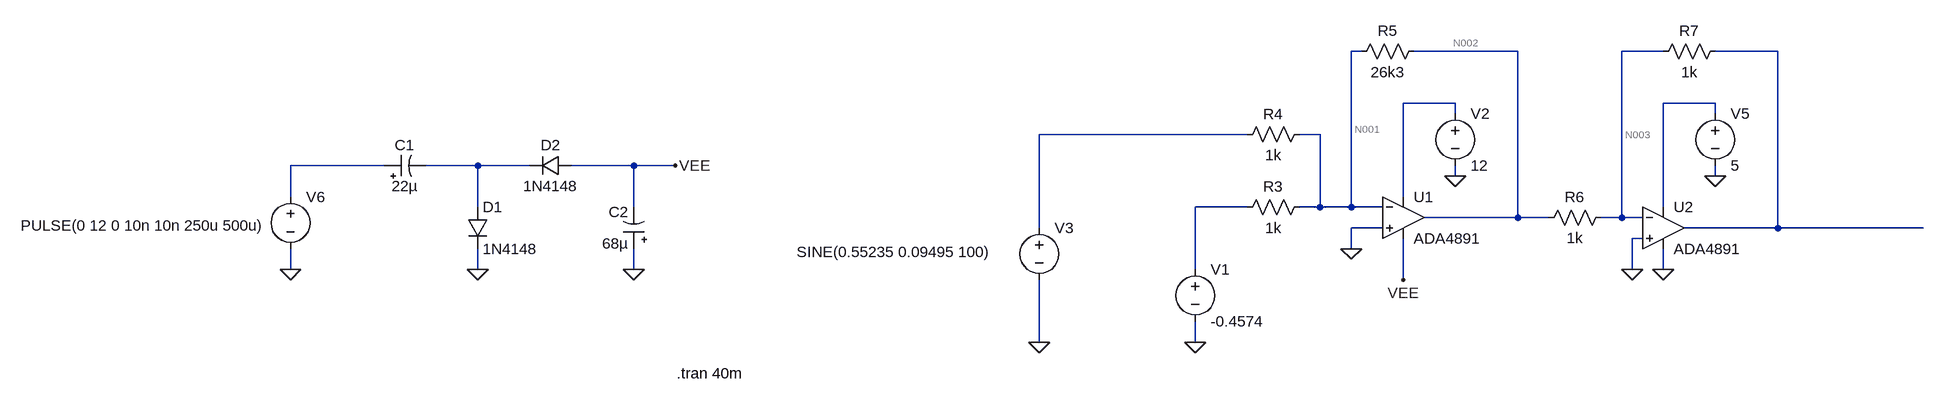
[diagram p0: schematic amp.asc]
amp.asc, the LTspice schematic file:
Version 4
SHEET 1 1384 680
WIRE 96 -96 80 -96
WIRE 336 -96 176 -96
WIRE 560 -96 496 -96
WIRE 736 -96 640 -96
WIRE 240 -16 160 -16
WIRE 640 -16 560 -16
WIRE 240 0 240 -16
WIRE 640 0 640 -16
WIRE -80 32 -400 32
WIRE 32 32 0 32
WIRE -1408 80 -1552 80
WIRE -1264 80 -1344 80
WIRE -1184 80 -1264 80
WIRE -1024 80 -1120 80
WIRE -960 80 -1024 80
WIRE 240 96 240 80
WIRE 640 96 640 80
WIRE -1552 128 -1552 80
WIRE 160 128 160 -16
WIRE -1264 144 -1264 80
WIRE -1024 144 -1024 80
WIRE -80 144 -160 144
WIRE 32 144 32 32
WIRE 32 144 0 144
WIRE 80 144 80 -96
WIRE 80 144 32 144
WIRE 128 144 80 144
WIRE 560 144 560 -16
WIRE 336 160 336 -96
WIRE 336 160 192 160
WIRE 384 160 336 160
WIRE 496 160 496 -96
WIRE 496 160 464 160
WIRE 528 160 496 160
WIRE -400 176 -400 32
WIRE 128 176 80 176
WIRE 736 176 736 -96
WIRE 736 176 592 176
WIRE 960 176 736 176
WIRE 528 192 512 192
WIRE 80 208 80 176
WIRE -1552 240 -1552 208
WIRE -1264 240 -1264 208
WIRE -1024 240 -1024 208
WIRE -160 240 -160 144
WIRE 512 240 512 192
WIRE 560 240 560 208
WIRE 160 256 160 192
WIRE -400 352 -400 256
WIRE -160 352 -160 320
FLAG -160 352 0
FLAG 240 96 0
FLAG -400 352 0
FLAG 80 208 0
FLAG 640 96 0
FLAG 512 240 0
FLAG 560 240 0
FLAG -1552 240 0
FLAG -1264 240 0
FLAG -1024 240 0
FLAG -960 80 VEE
FLAG 160 256 VEE
SYMBOL Opamps\\ADA4891 160 96 R0
SYMATTR InstName U1
SYMBOL voltage -160 224 R0
WINDOW 123 0 0 Left 0
WINDOW 39 0 0 Left 0
SYMATTR InstName V1
SYMATTR Value -0.4574
SYMBOL voltage 240 -16 R0
SYMATTR InstName V2
SYMATTR Value 12
SYMBOL voltage -400 160 R0
WINDOW 3 -373 53 Left 2
WINDOW 123 0 0 Left 0
WINDOW 39 0 0 Left 0
SYMATTR InstName V3
SYMATTR Value SINE(0.55235 0.09495 100)
SYMBOL res 16 128 R90
WINDOW 0 0 56 VBottom 2
WINDOW 3 32 56 VTop 2
SYMATTR InstName R3
SYMATTR Value 1k
SYMBOL res -96 48 R270
WINDOW 0 32 56 VTop 2
WINDOW 3 0 56 VBottom 2
SYMATTR InstName R4
SYMATTR Value 1k
SYMBOL res 192 -112 R90
WINDOW 0 0 56 VBottom 2
WINDOW 3 32 56 VTop 2
SYMATTR InstName R5
SYMATTR Value 26k3
SYMBOL Opamps\\ADA4891 560 112 R0
SYMATTR InstName U2
SYMBOL voltage 640 -16 R0
SYMATTR InstName V5
SYMATTR Value 5
SYMBOL res 480 144 R90
WINDOW 0 0 56 VBottom 2
WINDOW 3 32 56 VTop 2
SYMATTR InstName R6
SYMATTR Value 1k
SYMBOL res 656 -112 R90
WINDOW 0 0 56 VBottom 2
WINDOW 3 32 56 VTop 2
SYMATTR InstName R7
SYMATTR Value 1k
SYMBOL voltage -1552 112 R0
WINDOW 3 -415 60 Left 2
WINDOW 123 0 0 Left 0
WINDOW 39 0 0 Left 0
SYMATTR InstName V6
SYMATTR Value PULSE(0 12 0 10n 10n 250u 500u)
SYMBOL polcap -1408 96 R270
WINDOW 0 32 32 VTop 2
WINDOW 3 0 32 VBottom 2
SYMATTR InstName C1
SYMATTR Value 22µ
SYMATTR Description Capacitor
SYMATTR Type cap
SYMATTR SpiceLine V=6.3 Irms=3.10529 Rser=0.028 Lser=0 mfg="KEMET" pn="A700V226M006ATE028" type="Al electrolytic"
SYMBOL diode -1280 144 R0
SYMATTR InstName D1
SYMATTR Value 1N4148
SYMBOL diode -1120 64 R90
WINDOW 0 0 32 VBottom 2
WINDOW 3 32 32 VTop 2
SYMATTR InstName D2
SYMATTR Value 1N4148
SYMBOL polcap -1008 208 R180
WINDOW 0 24 57 Left 2
WINDOW 3 24 8 Left 2
SYMATTR InstName C2
SYMATTR Value 68µ
SYMATTR Description Capacitor
SYMATTR Type cap
SYMATTR SpiceLine V=6.3 Irms=3.10529 Rser=0.028 Lser=0 mfg="KEMET" pn="A700V226M006ATE028" type="Al electrolytic"
TEXT -958 400 Left 2 !.tran 40m

The netlist it stands for:
* amp.asc
XU1 0 N001 N005 VEE N002 ADA4891-1  ; pins In+ In- V+ V- OUT
V1 N010 0 -0.4574
V2 N005 0 12
V3 N007 0 SINE(0.55235 0.09495 100)
R3 N001 N010 1k
R4 N007 N001 1k
R5 N002 N001 26k3
XU2 0 N003 N006 0 N004 ADA4891-1  ; pins In+ In- V+ V- OUT
V5 N006 0 5
R6 N003 N002 1k
R7 N004 N003 1k
V6 N008 0 PULSE(0 12 0 10n 10n 250u 500u)
C1 N008 N009 22µ V=6.3 Irms=3.10529 Rser=0.028 Lser=0 mfg="KEMET" pn="A700V226M006ATE028" type="Al electrolytic"
D1 N009 0 1N4148
D2 VEE N009 1N4148
C2 0 VEE 68µ V=6.3 Irms=3.10529 Rser=0.028 Lser=0 mfg="KEMET" pn="A700V226M006ATE028" type="Al electrolytic"
.model D D
.lib standard.dio
.tran 40m
.lib ADA4891-1.lib
.backanno
.end

* Results of the author's LTspice run, read from the files saved beside the schematic
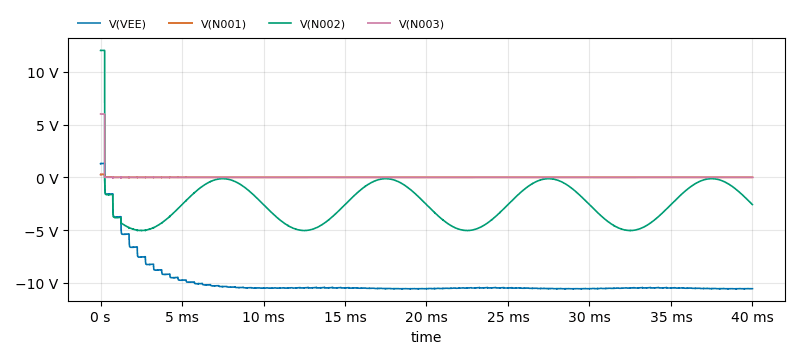
[diagram p1: Transient Analysis of amp.asc, plotted from the saved traces]
* Transient Analysis, 1 run:
*   V(VEE): min -10.58 V, max 1.32 V, average -9.986 V, rms 10.13 V, last -10.57 V
*   V(N001): min -29.74 mV, max 281.1 mV, average -45.2 µV, rms 22.37 mV, last -2.279 mV
*   V(N002): min -5.065 V, max 12.04 V, average -2.471 V, rms 3.233 V, last -2.59 V
*   V(N003): min -84.49 mV, max 6.005 V, average 34.75 mV, rms 475.4 mV, last -2.535 mV